# Altium project 5A_FOC_HybridStepperDrive.PrjPCB
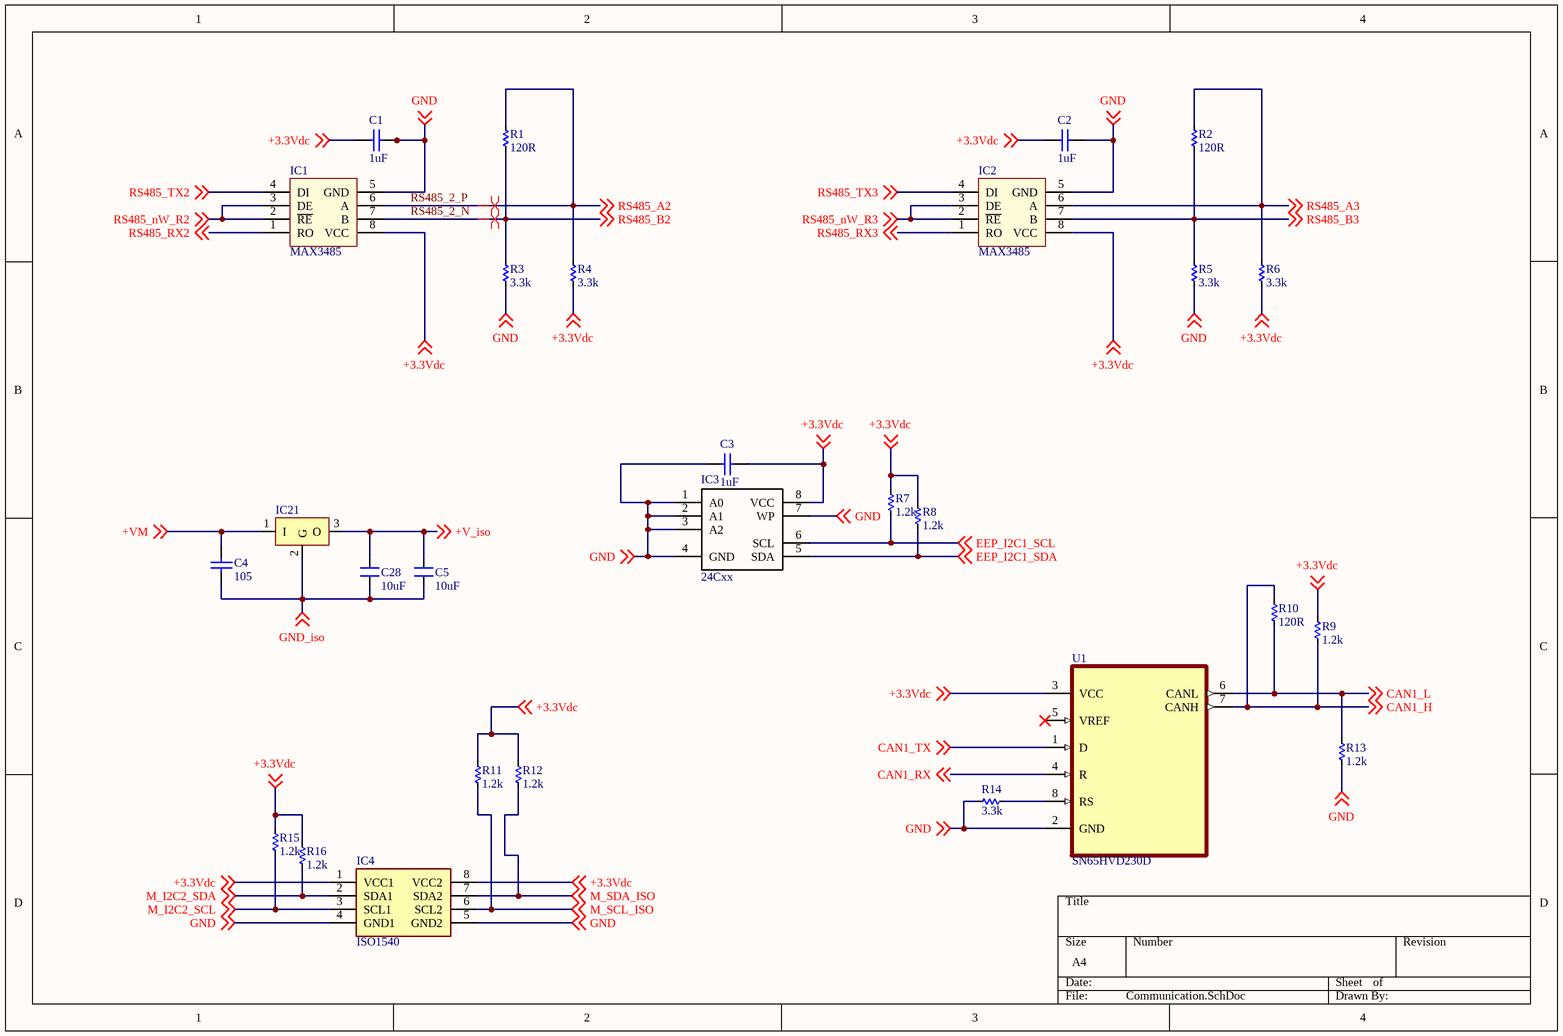
[diagram p0: Communication.SchDoc]
5 sheets, 89 parts. Net scope: flat (ports and power ports of the same name join across sheets).
Board file: PCB_5A_HYBRID_SERVO_V3_04_Oct_23.PcbDoc
Sheets:
  Communication.SchDoc
  DI_DO_AI_AO.SchDoc
  MCU_STM32L433RCT6.SchDoc
  Power_Supply.SchDoc
  Terminal.SchDoc

## Sheet Communication.SchDoc
size A4

### Parts
C1  1uF  [tu 0603]
C2  1uF  [tu 0603]
C3  1uF  [tu 0603]
C4  105  [tu 1206]
C5  10uF  [CM-0805 capacitor]
C28  10uF  [CM-0805 capacitor]
IC1  MAX3485  [SO8]
IC2  MAX3485  [SO8]
IC3  24Cxx  [SO8]
IC4  ISO1540  [SOIC127P600X175-8N]
IC21  78M05  [TO252-123]  (value not drawn)
R1  120R  [RES-SMD-0603]
R2  120R  [RES-SMD-0603]
R3  3.3k  [RES-SMD-0603]
R4  3.3k  [RES-SMD-0603]
R5  3.3k  [RES-SMD-0603]
R6  3.3k  [RES-SMD-0603]
R7  1.2k  [RES-SMD-0603]
R8  1.2k  [RES-SMD-0603]
R9  1.2k  [RES-SMD-0603]
R10  120R  [RES-SMD-0603]
R11  1.2k  [RES-SMD-0603]
R12  1.2k  [RES-SMD-0603]
R13  1.2k  [RES-SMD-0603]
R14  3.3k  [RES-SMD-0603]
R15  1.2k  [RES-SMD-0603]
R16  1.2k  [RES-SMD-0603]
U1  SN65HVD230D  [SO8]

### Nets
+3.3Vdc: C1.1 C2.1 C3.2 IC1.8(VCC) IC2.8(VCC) IC3.8(VCC) IC4.1(VCC1) IC4.8(VCC2) R4.2 R6.2 R7.1 R8.1 R9.1 R11.1 R12.1 R15.1 R16.1 U1.3(VCC) ; off-sheet +3.3Vdc
+V_iso: C5.2 C28.1 IC21.3(O) ; off-sheet +V_iso
+VM: C4.1 IC21.1(I) ; off-sheet +VM
CAN1_H: R9.2 R10.1 U1.7(CANH) ; off-sheet CAN1_H
CAN1_L: R10.2 R13.1 U1.6(CANL) ; off-sheet CAN1_L
CAN1_RX: U1.4(R) ; off-sheet CAN1_RX
CAN1_TX: U1.1(D) ; off-sheet CAN1_TX
EEP_I2C1_SCL: IC3.6(SCL) R7.2 ; off-sheet EEP_I2C1_SCL
EEP_I2C1_SDA: IC3.5(SDA) R8.2 ; off-sheet EEP_I2C1_SDA
GND: C1.2 C2.2 C3.1 IC1.5(GND) IC2.5(GND) IC3.1(A0) IC3.2(A1) IC3.3(A2) IC3.4(GND) IC3.7(WP) IC4.4(GND1) IC4.5(GND2) R3.2 R5.2 R13.2 R14.1 U1.2(GND) ; off-sheet GND
GND_iso: C4.2 C5.1 C28.2 IC21.2(G) ; off-sheet GND_iso
M_I2C2_SCL: IC4.3(SCL1) R15.2 ; off-sheet M_I2C2_SCL
M_I2C2_SDA: IC4.2(SDA1) R16.2 ; off-sheet M_I2C2_SDA
M_SCL_ISO: IC4.6(SCL2) R11.2 ; off-sheet M_SCL_ISO
M_SDA_ISO: IC4.7(SDA2) R12.2 ; off-sheet M_SDA_ISO
RS485_2_N: IC1.7(B) R1.2 R3.1 ; off-sheet RS485_B2  [also labelled RS485_B2]
RS485_2_P: IC1.6(A) R1.1 R4.1 ; off-sheet RS485_A2  [also labelled RS485_A2]
RS485_A3: IC2.6(A) R2.1 R6.1 ; off-sheet RS485_A3
RS485_B3: IC2.7(B) R2.2 R5.1 ; off-sheet RS485_B3
RS485_nW_R2: IC1.2(~{RE}) IC1.3(DE) ; off-sheet RS485_nW_R2
RS485_nW_R3: IC2.2(~{RE}) IC2.3(DE) ; off-sheet RS485_nW_R3
RS485_RX2: IC1.1(RO) ; off-sheet RS485_RX2
RS485_RX3: IC2.1(RO) ; off-sheet RS485_RX3
RS485_TX2: IC1.4(DI) ; off-sheet RS485_TX2
RS485_TX3: IC2.4(DI) ; off-sheet RS485_TX3
NetR14_2: R14.2 U1.8(RS)

Not connected (* = marked no-connect by the designer): U1 5(VREF)*

### Layout directives
differential pair: RS485_2_N, RS485_2_P

### Library data of the parts
C1-C3 = Tu 0603 102 50V 10%: Dán; Don_Vi: Con; So_Chan: 2; Ten_Linh_Kien: Tụ 0603 102-1nF 10% 50V; Ma_Hang: MH004566; Chung_Loai: Dán; Kieu_Chan: *
C4 = Tu 1206 105 50V 20%: Dán; Don_Vi: Con; So_Chan: 2; Ten_Linh_Kien: Tụ 1206 105-1uF 20% 50V; Ma_Hang: MH004545; Chung_Loai: Dán; Kieu_Chan: *
C5 C28 = CN: 0805_SMD_20pF; Value: 100pF
IC1 IC2 = MAX485: RS232 - RS485 (Same sn75176)
IC3 = 24Cxx: Standard 2-Wire Bus Interface Serial EEPROM; Value: DIP 8; Value: 24Cxx; Copyright by: VanDungEvn
IC4 = HPA02222DR: Integrated Circuit; Manufacturer_Name: Texas Instruments; Datasheet Link: http://www.ti.com/general/docs/suppproductinfo.tsp?distId=26&gotoUrl=http%3A%2F%2Fwww.ti.com%2Flit%2Fgpn%2Fiso1540; Height: 1.75mm; Manufacturer_Part_Number: HPA02222DR; Mouser Part Number: 595-HPA02222DR; Mouser Price/Stock: https://www.mouser.co.uk/ProductDetail/Texas-Instruments/HPA02222DR?qs=CinXaP2cUj2opC1RRUOhNg%3D%3D
IC21 = LM78xx: Positive Voltage Regulator; Note: Tab is connected to pin 3 (GND).; Published: 24-Aug-2001; LatestRevisionDate: 17-Jul-2002; LatestRevisionNote: Re-released for DXP Platform.; DatasheetVersion: Apr-1994; PackageVersion: Jul-1998; PackageReference: ISOWATT220AB; Publisher: Altium Limited; PackageDescription: TO, Thru-Hole, Vertical, Heatsink Mounted; 3 In-Line Leads; Pitch 2.54 mm; Pin sequence 1, 3, 2; ComponentLink1Description: Manufacturer Link; ComponentLink1URL: http://www.st.com/; ComponentLink2Description: Datasheet; ComponentLink2URL: http://www.st.com/stonline/products/literature/ds/2146/l78m05c.pdf
R1-R16 = Res-SMD: Resistor; Manufacturer: Generic Components; Class: Passive; Published: 08/06/2000; Publisher: Altium Hobart Technology Centre
U1 = SN65HVD230D: 1/1 Transceiver Half CANbus 8-SOIC; MF: Texas Instruments; Digi-Key_Purchase_URL: https://www.digikey.de/product-detail/en/texas-instruments/SN65HVD230D/SN65HVD230D-ND/1574496?utm_source=snapeda&utm_medium=aggregator&utm_campaign=symbol; Digi-Key_Part_Number: SN65HVD230D-ND; SnapEDA_Link: https://www.snapeda.com/parts/SN65HVD230D/Texas%20Instruments/view-part/51766/?ref=snap; Package: SOIC-8 Texas Instruments; Value: *; MP: SN65HVD230D

## Sheet DI_DO_AI_AO.SchDoc
size A4
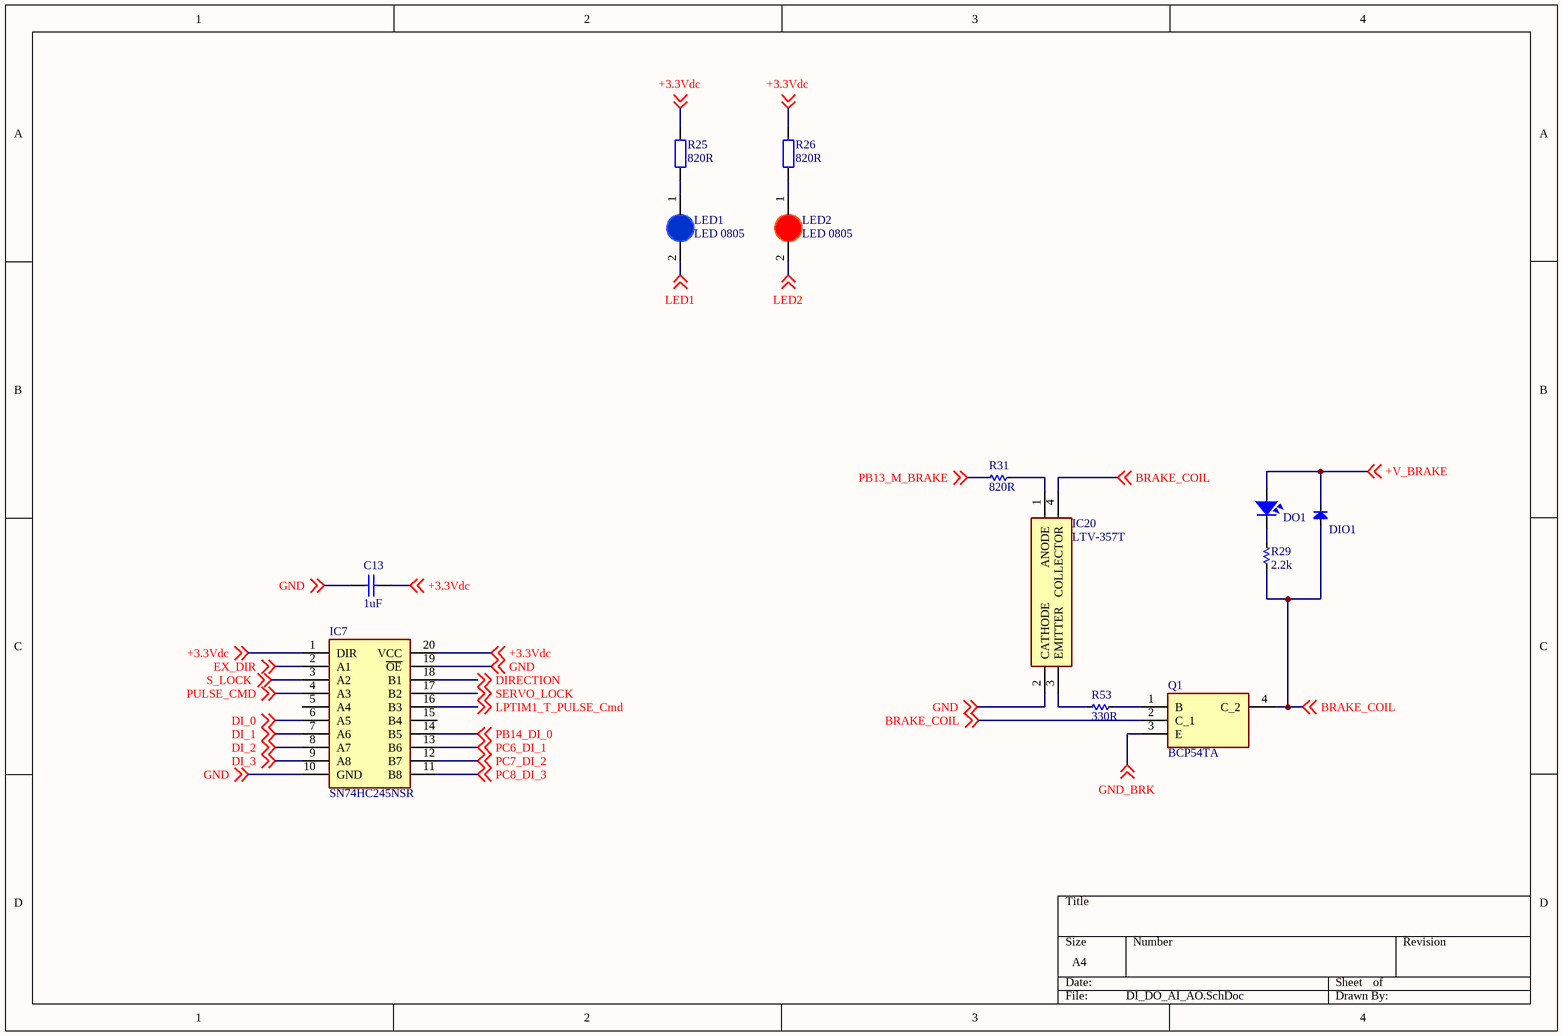
[diagram p1: DI_DO_AI_AO.SchDoc]

### Parts
C13  1uF  [tu 0805]
DIO1  Diode SMD  [DIO-SMD-106]  (value not drawn)
DO1  LED  [LED-0805-Yellow]  (value not drawn)
IC7  SN74HC245NSR  [SOIC127P780X200-20N]
IC20  LTV-357T  [LTV-357T]
LED1  LED 0805  [LED-0805-Blue]
LED2  LED 0805  [LED-0805-Red]
Q1  BCP54TA  [SOT230P700X165-4N]
R25  820R  [tro smd 0805]
R26  820R  [tro smd 0805]
R29  2.2k  [RES-SMD-0805]
R31  820R  [RES-SMD-0805]
R53  330R  [RES-SMD-0805]

### Nets
+3.3Vdc: C13.1 IC7.1(DIR) IC7.20(VCC) R25.2 R26.2 ; off-sheet +3.3Vdc
+V_BRAKE: DIO1.2(K) DO1.1 ; off-sheet +V_BRAKE
BRAKE_COIL: DIO1.1(A) IC20.4(COLLECTOR) Q1.2(C_1) Q1.4(C_2) R29.2 ; off-sheet BRAKE_COIL
DI_0: IC7.6(A5) ; off-sheet DI_0
DI_1: IC7.7(A6) ; off-sheet DI_1
DI_2: IC7.8(A7) ; off-sheet DI_2
DI_3: IC7.9(A8) ; off-sheet DI_3
DIRECTION: IC7.18(B1) ; off-sheet DIRECTION
EX_DIR: IC7.2(A1) ; off-sheet EX_DIR
GND: C13.2 IC7.10(GND) IC7.19(~{OE}) IC20.2(CATHODE) ; off-sheet GND
GND_BRK: Q1.3(E) ; off-sheet GND_BRK
LED1: LED1.2(K) ; off-sheet LED1
LED2: LED2.2(K) ; off-sheet LED2
LPTIM1_T_PULSE_Cmd: IC7.16(B3) ; off-sheet LPTIM1_T_PULSE_Cmd
PB13_M_BRAKE: R31.2 ; off-sheet PB13_M_BRAKE
PB14_DI_0: IC7.14(B5) ; off-sheet PB14_DI_0
PC6_DI_1: IC7.13(B6) ; off-sheet PC6_DI_1
PC7_DI_2: IC7.12(B7) ; off-sheet PC7_DI_2
PC8_DI_3: IC7.11(B8) ; off-sheet PC8_DI_3
PULSE_CMD: IC7.4(A3) ; off-sheet PULSE_CMD
S_LOCK: IC7.3(A2) ; off-sheet S_LOCK
SERVO_LOCK: IC7.17(B2) ; off-sheet SERVO_LOCK
NetDO1_2: DO1.2 R29.1
NetIC20_1: IC20.1(ANODE) R31.1
NetIC20_3: IC20.3(EMITTER) R53.2
NetLED1_1: LED1.1(A) R25.1
NetLED2_1: LED2.1(A) R26.1
NetQ1_1: Q1.1(B) R53.1

Not connected (* = marked no-connect by the designer): IC7 5(A4) 15(B4)

### Library data of the parts
C13 = Tu 0805 10pF 50V 10%: Dán; Don_Vi: Con; So_Chan: 2; Ten_Linh_Kien: Tụ 0805 10P 10% 50V; Ma_Hang: MH004554; Chung_Loai: Dán; Kieu_Chan: *
DIO1 = Diode SMD: Default Diode; Code - JEDEC: DO-214-AB; Value: 1N5007; Published: 8-Jun-2000; Revision: July-2002: Re-released for DXP Platform.; Publisher: Altium Limited
DO1 = LED SMD: Value: LED 3 - 5 ly 2 Colour
IC7 = SN74HC245NSR: Integrated Circuit; Manufacturer_Name: Texas Instruments; Datasheet Link: https://www.ti.com/lit/gpn/SN74HC245; Height: 2mm; Manufacturer_Part_Number: SN74HC245NSR; Mouser Part Number: 595-SN74HC245NSR; Mouser Price/Stock: https://www.mouser.co.uk/ProductDetail/Texas-Instruments/SN74HC245NSR?qs=YhsVCygOPE264XdBhel1Tg%3D%3D; Arrow Part Number: SN74HC245NSR; Arrow Price/Stock: https://www.arrow.com/en/products/sn74hc245nsr/texas-instruments?region=nac
IC20 = LTV-357T: Integrated Circuit; Manufacturer_Name: Lite-On; Datasheet Link: http://uk.rs-online.com/web/p/products/6912088; Manufacturer_Part_Number: LTV-357T; Mouser Part Number: 859-LTV-357T; Mouser Price/Stock: https://www.mouser.co.uk/ProductDetail/Lite-On/LTV-357T?qs=IhlP1sn3qi5zhJzi4zUCwQ%3D%3D; Arrow Part Number: LTV-357T; Arrow Price/Stock: https://www.arrow.com/en/products/ltv-357t/lite-on-technology?region=nac
LED1 = LED 0805 Xanh Duong: Dán; Don_Vi: Con; Ma_Hang: MH002327; Ten_Linh_Kien: LED 0805 Màu Xanh Dương (Blue); Ghi_Chu: *; Kieu_Chan: *; Chung_Loai: Dán
LED2 = LED 0805 Do: Dán; Don_Vi: Con; Ma_Hang: MH000897; Ten_Linh_Kien: LED 0805 Màu Đỏ (Red); Ghi_Chu: *; Kieu_Chan: *; Chung_Loai: Dán
Q1 = BCP54TA: Transistor BJT NPN; Manufacturer_Name: Diodes Inc.; Datasheet Link: https://www.diodes.com/assets/Datasheets/BCP54_55_56.pdf; Height: 1.65mm; Manufacturer_Part_Number: BCP54TA; Mouser Part Number: 522-BCP54TA; Mouser Price/Stock: https://www.mouser.co.uk/ProductDetail/Diodes-Incorporated/BCP54TA?qs=fKsNvYl5pt81P4xkpCoZ4w%3D%3D; Arrow Part Number: BCP54TA; Arrow Price/Stock: https://www.arrow.com/en/products/bcp54ta/diodes-incorporated?region=nac
R25 R26 = Tro 0805 1% 2k: Dán; Don_Vi: Con; So_Chan: 2; Ten_Linh_Kien: Trở 0805 1% 2k; Ma_Hang: MH005471; Chung_Loai: Dán; Kieu_Chan: *
R29 R31 R53 = Res-SMD: as R1 on sheet Communication; Published: 08/06/2000; Publisher: Altium Hobart Technology Centre

## Sheet MCU_STM32L433RCT6.SchDoc
size A4
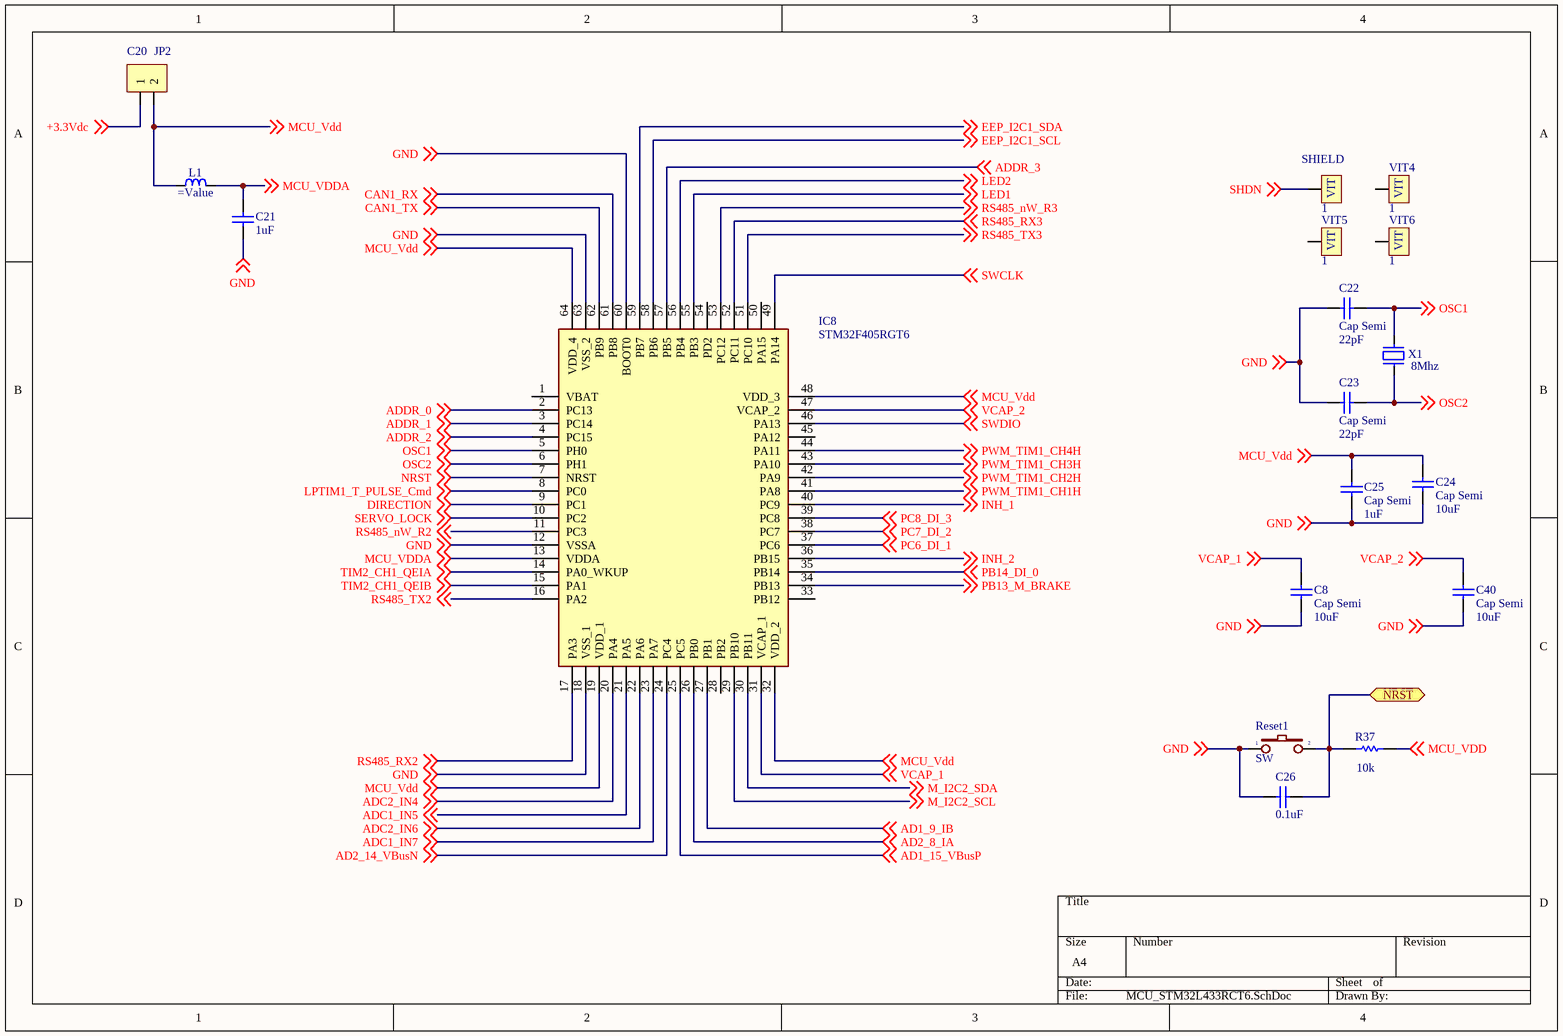
[diagram p2: MCU_STM32L433RCT6.SchDoc]

### Parts
C8  Cap Semi  value 10uF  [CN-SMD-0805]
C20  JP2  [JP2-CLOSED]
C21  1uF  [tu 0805]
C22  Cap Semi  value 22pF  [CN-SMD-0805]
C23  Cap Semi  value 22pF  [CN-SMD-0805]
C24  Cap Semi  value 10uF  [CN-SMD-0805]
C25  Cap Semi  value 1uF  [CN-SMD-0805]
C26  0.1uF  [CN-SMD-0805]
C40  Cap Semi  value 10uF  [CN-SMD-0805]
IC8  STM32F405RGT6  [QFP50P1200X1200X160-64N]
L1  (no value)  [RES 0805]
R37  value 10k  [RES-SMD-0805]  (hidden comment: 0805)
Reset1  SW  [SW1-SMD]
SHIELD  1  [VIT]
VIT4  1  [VIT]
VIT5  1  [VIT]
VIT6  1  [VIT]
X1  8Mhz  [XT2]

### Ports
NRST (bidir)

### Nets
+3.3Vdc: C20.1 ; off-sheet +3.3Vdc
AD1_9_IB: IC8.27(PB1) ; off-sheet AD1_9_IB
AD1_15_VBusP: IC8.25(PC5) ; off-sheet AD1_15_VBusP
AD2_8_IA: IC8.26(PB0) ; off-sheet AD2_8_IA
AD2_14_VBusN: IC8.24(PC4) ; off-sheet AD2_14_VBusN
ADC1_IN5: IC8.21(PA5) ; off-sheet ADC1_IN5
ADC1_IN7: IC8.23(PA7) ; off-sheet ADC1_IN7
ADC2_IN4: IC8.20(PA4) ; off-sheet ADC2_IN4
ADC2_IN6: IC8.22(PA6) ; off-sheet ADC2_IN6
ADDR_0: IC8.2(PC13) ; off-sheet ADDR_0
ADDR_1: IC8.3(PC14) ; off-sheet ADDR_1
ADDR_2: IC8.4(PC15) ; off-sheet ADDR_2
ADDR_3: IC8.57(PB5) ; off-sheet ADDR_3
CAN1_RX: IC8.61(PB8) ; off-sheet CAN1_RX
CAN1_TX: IC8.62(PB9) ; off-sheet CAN1_TX
DIRECTION: IC8.9(PC1) ; off-sheet DIRECTION
EEP_I2C1_SCL: IC8.58(PB6) ; off-sheet EEP_I2C1_SCL
EEP_I2C1_SDA: IC8.59(PB7) ; off-sheet EEP_I2C1_SDA
GND: C8.1 C21.1 C22.1 C23.1 C24.1 C25.1 C26.1 C40.1 IC8.12(VSSA) IC8.18(VSS_1) IC8.60(BOOT0) IC8.63(VSS_2) Reset1.1 ; off-sheet GND
INH_1: IC8.40(PC9) ; off-sheet INH_1
INH_2: IC8.36(PB15) ; off-sheet INH_2
LED1: IC8.55(PB3) ; off-sheet LED1
LED2: IC8.56(PB4) ; off-sheet LED2
LPTIM1_T_PULSE_Cmd: IC8.8(PC0) ; off-sheet LPTIM1_T_PULSE_Cmd
M_I2C2_SCL: IC8.29(PB10) ; off-sheet M_I2C2_SCL
M_I2C2_SDA: IC8.30(PB11) ; off-sheet M_I2C2_SDA
MCU_VDD: C20.2 C24.2 C25.2 IC8.19(VDD_1) IC8.32(VDD_2) IC8.48(VDD_3) IC8.64(VDD_4) L1.1 R37.2 ; off-sheet MCU_VDD, off-sheet MCU_Vdd
MCU_VDDA: C21.2 IC8.13(VDDA) L1.2 ; off-sheet MCU_VDDA
NRST: IC8.7(NRST) ; off-sheet NRST
OSC1: C22.2 IC8.5(PH0) X1.1 ; off-sheet OSC1
OSC2: C23.2 IC8.6(PH1) X1.2 ; off-sheet OSC2
PB13_M_BRAKE: IC8.34(PB13) ; off-sheet PB13_M_BRAKE
PB14_DI_0: IC8.35(PB14) ; off-sheet PB14_DI_0
PC6_DI_1: IC8.37(PC6) ; off-sheet PC6_DI_1
PC7_DI_2: IC8.38(PC7) ; off-sheet PC7_DI_2
PC8_DI_3: IC8.39(PC8) ; off-sheet PC8_DI_3
PWM_TIM1_CH1H: IC8.41(PA8) ; off-sheet PWM_TIM1_CH1H
PWM_TIM1_CH2H: IC8.42(PA9) ; off-sheet PWM_TIM1_CH2H
PWM_TIM1_CH3H: IC8.43(PA10) ; off-sheet PWM_TIM1_CH3H
PWM_TIM1_CH4H: IC8.44(PA11) ; off-sheet PWM_TIM1_CH4H
RS485_nW_R2: IC8.11(PC3) ; off-sheet RS485_nW_R2
RS485_nW_R3: IC8.53(PC12) ; off-sheet RS485_nW_R3
RS485_RX2: IC8.17(PA3) ; off-sheet RS485_RX2
RS485_RX3: IC8.52(PC11) ; off-sheet RS485_RX3
RS485_TX2: IC8.16(PA2) ; off-sheet RS485_TX2
RS485_TX3: IC8.51(PC10) ; off-sheet RS485_TX3
SERVO_LOCK: IC8.10(PC2) ; off-sheet SERVO_LOCK
SHDN: SHIELD.VIT1 ; off-sheet SHDN
SWCLK: IC8.49(PA14) ; off-sheet SWCLK
SWDIO: IC8.46(PA13) ; off-sheet SWDIO
TIM2_CH1_QEIA: IC8.14(PA0_WKUP) ; off-sheet TIM2_CH1_QEIA
TIM2_CH1_QEIB: IC8.15(PA1) ; off-sheet TIM2_CH1_QEIB
VCAP_1: C8.2 IC8.31(VCAP_1) ; off-sheet VCAP_1
VCAP_2: C40.2 IC8.47(VCAP_2) ; off-sheet VCAP_2
NetC26_2: C26.2 R37.1 Reset1.2 ; port NRST

Not connected (* = marked no-connect by the designer): IC8 1(VBAT) 28(PB2) 33(PB12) 45(PA12) 50(PA15) 54(PD2); VIT4 VIT1(1); VIT5 VIT1(1); VIT6 VIT1(1)

### Library data of the parts
C8 C22-C26 C40 = Cap Semi: Capacitor (Semiconductor SIM Model); Published: 8-Jun-2000; LatestRevisionDate: 29-May-2009; LatestRevisionNote: IPC-7351 Footprint Added.; PackageReference: C1206; Publisher: Altium Limited; PackageDescription: Chip Capacitor
C20 = JP2: WR-PHD 2.54 mm Angled Socket Header; Manufacturer: W¨¹rth Elektronik eiSos GmbH; partNo: 613002143121; ComponentLink1 Description: Manufacturer; ComponentLink2 Description: Datasheet; NoPins: 02; Created Date: 29 March 2013; ComponentLink1URL: http://www.we-online.com; ComponentLink2URL: http://katalog.we-online.de/em/datasheet/6130xx143121.pdf; Created by: Karrer Zheng
C21 = Tu 0805 10pF 50V 10%: as C13 on sheet DI_DO_AI_AO; Chung_Loai: Dán; Kieu_Chan: *
IC8 = STM32F405RGT6: Integrated Circuit; Manufacturer_Name: STMicroelectronics; Datasheet Link: http://www.st.com/web/en/resource/technical/document/datasheet/DM00037051.pdf; Height: 1.6mm; Manufacturer_Part_Number: STM32F405RGT6; Mouser Part Number: 511-STM32F405RGT6; Mouser Price/Stock: https://www.mouser.co.uk/ProductDetail/STMicroelectronics/STM32F405RGT6?qs=Z8%252BeY1k3TIKgj7QWsYGpQw%3D%3D; Arrow Part Number: STM32F405RGT6; Arrow Price/Stock: https://www.arrow.com/en/products/stm32f405rgt6/stmicroelectronics?region=nac
L1 = Inductor
R37 = Res1: Resistor; Published: 8-Jun-2000; LatestRevisionDate: 17-Jul-2002; LatestRevisionNote: Re-released for DXP Platform.; PackageReference: AXIAL-0.3; Publisher: Altium Limited; PackageDescription: Axial Device, Thru-Hole; 2 Leads; 0.3 in Pin Spacing
Reset1 = SW2: Switch button 2 pin; Value: SW chip 2 pin
SHIELD VIT4-VIT6 = VIT: Oc Vit
X1 = XT2: Crystal, 32.768 KHz, -40 to 85 degC, 3.2 x 1.5 x 0.9 mm SMD; Value: 4Mhz

## Sheet Power_Supply.SchDoc
size A4
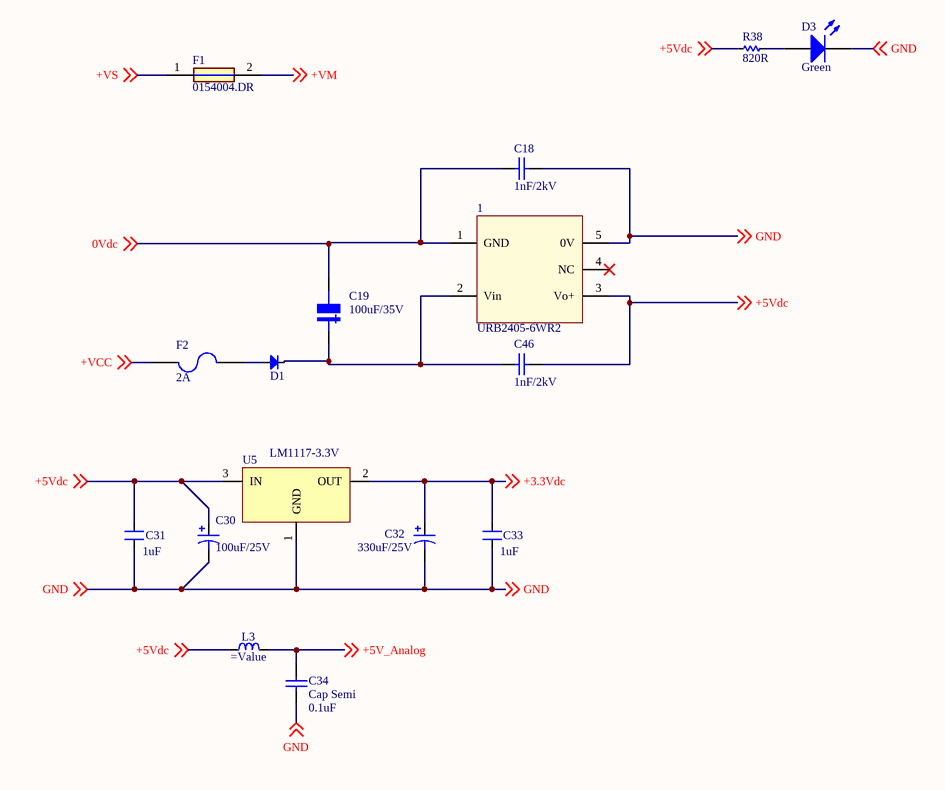
[diagram p3: Power_Supply.SchDoc]

### Parts
1  URB2405-6WR2  [URB2405_6WR2]
C18  1nF/2kV  [Cap 3KV 5mm]
C19  100uF/35V  [tu nhom 10 (g)]
C30  100uF/25V  [Cap size C]
C31  1uF  [CM-0805 capacitor]
C32  330uF/25V  [Cap size C]
C33  1uF  [CM-0805 capacitor]
C34  Cap Semi  value 0.1uF  [CN-SMD-0805]
C46  1nF/2kV  [Cap 3KV 5mm]
D1  Diode SMD  [DIO-SMD-A]  (value not drawn)
D3  Green  [LED-0805-Green]
F1  0154004.DR  [0154001.DRT]
F2  2A  [FUSE_RESETTABLE_SMD_1812]
L3  (no value)  [RES 1206]
R38  820R  [RES-SMD-0805]
U5  LM1117-3.3V  [SOT223]

### Nets
0Vdc: 1.1(GND) C18.1 C19.2 ; off-sheet 0Vdc
+3.3Vdc: C32.1 C33.1 U5.2(OUT) ; off-sheet +3.3Vdc
+5V_Analog: C34.1 L3.2 ; off-sheet +5V_Analog
+5Vdc: 1.3(Vo+) C30.1 C31.1 C46.2 L3.1 R38.1 U5.3(IN) ; off-sheet +5Vdc
+VCC: F2.1 ; off-sheet +VCC
+VM: F1.2 ; off-sheet +VM
+VS: F1.1 ; off-sheet +VS
GND: 1.5(0V) C18.2 C30.2 C31.2 C32.2 C33.2 C34.2 D3.2(K) U5.1(GND) ; off-sheet GND
Net1_2: 1.2(Vin) C19.1 C46.1 D1.2(K)
NetD1_1: D1.1(A) F2.2
NetD3_1: D3.1(A) R38.2

Not connected (* = marked no-connect by the designer): 1 4(NC)*

### Notes on the sheet
- (in symbol Tu Nhom 100uF 35V) +

### Library data of the parts
C18 C46 = Cap: Capacitor; Published: 8-Jun-2000; LatestRevisionDate: 17-Jul-2002; LatestRevisionNote: Re-released for DXP Platform.; PackageReference: RAD-0.3; Publisher: Altium Limited; Value: 1nF/2kV
C19 = Tu Nhom 100uF 35V: Dán; Don_Vi: Con; Ten_Linh_Kien: Tụ Nhôm 100uF 35V; Ma_Hang: MH004019; So_Chan: 2; Chung_Loai: Dán; Kieu_Chan: *
C30 C32 = Cap Pol2: Polarized Capacitor (Axial); Published: 8-Jun-2000; LatestRevisionDate: 17-Jul-2002; LatestRevisionNote: Re-released for DXP Platform.; PackageReference: POLAR0.8; Publisher: Altium Limited
C31 C33 = CN: 0805_SMD_20pF; Value: 100pF
C34 = Cap Semi: Capacitor (Semiconductor SIM Model); Published: 8-Jun-2000; LatestRevisionDate: 29-May-2009; LatestRevisionNote: IPC-7351 Footprint Added.; PackageReference: C1206; Publisher: Altium Limited; PackageDescription: Chip Capacitor
D1 = Diode SMD: as DIO1 on sheet DI_DO_AI_AO; Published: 8-Jun-2000; Revision: July-2002: Re-released for DXP Platform.; Publisher: Altium Limited
D3 = LED2: Typical RED, GREEN, YELLOW, AMBER GaAs LED; Published: 8-Jun-2000; LatestRevisionDate: 17-Jul-2002; LatestRevisionNote: Re-released for DXP Platform.; PackageVersion: Feb-2002; PackageReference: 3.2X1.6X1.1; Publisher: Altium Limited; PackageDescription: SM LED; 2 Flat Leads
F1 = 0154004.DR: Fuse; Manufacturer_Name: LITTELFUSE; Datasheet Link: http://m.littelfuse.com/~/media/electronics/datasheets/fuses/littelfuse_fuse_154_154t_154l_154tl_datasheet.pdf.pdf; Manufacturer_Part_Number: 0154004.DR; Mouser Part Number: 576-0154004.DR; Mouser Price/Stock: https://www.mouser.co.uk/ProductDetail/Littelfuse/0154004.DR?qs=gu7KAQ731UQeedYeniUNnQ%3D%3D; Arrow Part Number: 0154004.DR; Arrow Price/Stock: https://www.arrow.com/en/products/0154004.dr/littelfuse?region=nac
F2 = Fuse 2: Fuse; Published: 8-Jun-2000; LatestRevisionDate: 17-Jul-2002; LatestRevisionNote: Re-released for DXP Platform.; PackageReference: PIN-W2/E2.8; Publisher: Altium Limited
L3 = Inductor
R38 = Res-SMD: as R1 on sheet Communication; Published: 08/06/2000; Publisher: Altium Hobart Technology Centre
U5 = LM1117: 800mA Low-Dropout Linear Regulator; Creator: Nguyen Ba Bien; Website: http://group3i.net

## Sheet Terminal.SchDoc
size A4
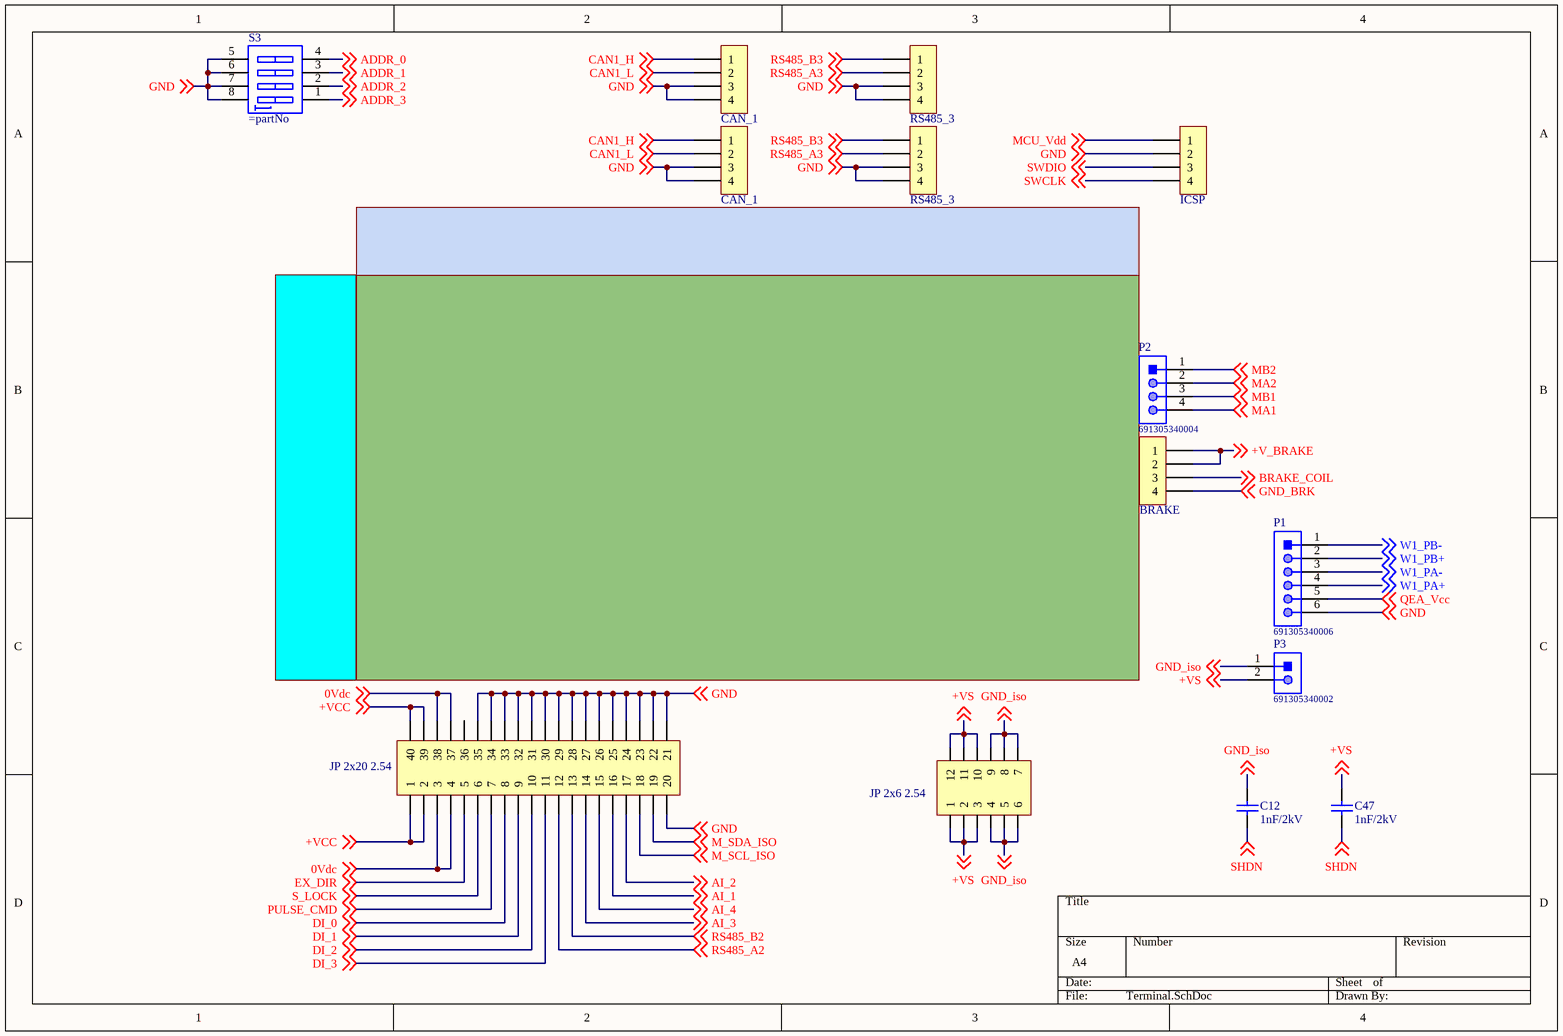
[diagram p4: Terminal.SchDoc]

### Parts
C12  1nF/2kV  [Cap 3KV 5mm]
C47  1nF/2kV  [Cap 3KV 5mm]
H1  CAN_1  [Header 4P DC 2.54]
H2  RS485_3  [Header 4P DC 2.54]
H4  ICSP  [Header 4P DC 2.54]
H5  BRAKE  [Header 4P DC 2.54]
H6  CAN_1  [Header 4P DC 2.54]
H8  RS485_3  [Header 4P DC 2.54]
JP1  JP 2x20 2.54  [JP 2x20 DC]
JP2  JP 2x6 2.54  [JP 2x6 DC]
P1  691305340006  [691305340006]
P2  691305340004  [691305340004]
P3  691305340002  [691305340002]
S3  (no value)  [SW-DIP4]

### Nets
0Vdc: JP1.3 JP1.4 JP1.37 JP1.38 ; off-sheet 0Vdc
+V_BRAKE: H5.1 H5.2 ; off-sheet +V_BRAKE
+VCC: JP1.1 JP1.2 JP1.39 JP1.40 ; off-sheet +VCC
+VS: C47.2 JP2.1 JP2.2 JP2.3 JP2.10 JP2.11 JP2.12 P3.2 ; off-sheet +VS
ADDR_0: S3.4 ; off-sheet ADDR_0
ADDR_1: S3.3 ; off-sheet ADDR_1
ADDR_2: S3.2 ; off-sheet ADDR_2
ADDR_3: S3.1 ; off-sheet ADDR_3
AI_1: JP1.16 ; off-sheet AI_1
AI_2: JP1.17 ; off-sheet AI_2
AI_3: JP1.14 ; off-sheet AI_3
AI_4: JP1.15 ; off-sheet AI_4
BRAKE_COIL: H5.3 ; off-sheet BRAKE_COIL
CAN1_H: H1.1 H6.1 ; off-sheet CAN1_H
CAN1_L: H1.2 H6.2 ; off-sheet CAN1_L
DI_0: JP1.8 ; off-sheet DI_0
DI_1: JP1.9 ; off-sheet DI_1
DI_2: JP1.10 ; off-sheet DI_2
DI_3: JP1.11 ; off-sheet DI_3
EX_DIR: JP1.5 ; off-sheet EX_DIR
GND: H1.3 H1.4 H2.3 H2.4 H4.2 H6.3 H6.4 H8.3 H8.4 JP1.20 JP1.21 JP1.22 JP1.23 JP1.24 JP1.25 JP1.26 JP1.27 JP1.28 JP1.29 JP1.30 JP1.31 JP1.32 JP1.33 JP1.34 JP1.35 P1.6 S3.5 S3.6 S3.7 S3.8 ; off-sheet GND
GND_BRK: H5.4 ; off-sheet GND_BRK
GND_iso: C12.2 JP2.4 JP2.5 JP2.6 JP2.7 JP2.8 JP2.9 P3.1 ; off-sheet GND_iso
M_SCL_ISO: JP1.18 ; off-sheet M_SCL_ISO
M_SDA_ISO: JP1.19 ; off-sheet M_SDA_ISO
MA1: P2.4 ; off-sheet MA1
MA2: P2.2 ; off-sheet MA2
MB1: P2.3 ; off-sheet MB1
MB2: P2.1 ; off-sheet MB2
MCU_VDD: H4.1 ; off-sheet MCU_Vdd
PULSE_CMD: JP1.7 ; off-sheet PULSE_CMD
QEA_Vcc: P1.5 ; off-sheet QEA_Vcc
RS485_A2: JP1.12 ; off-sheet RS485_A2  [project net RS485_2_P]
RS485_A3: H2.2 H8.2 ; off-sheet RS485_A3
RS485_B2: JP1.13 ; off-sheet RS485_B2  [project net RS485_2_N]
RS485_B3: H2.1 H8.1 ; off-sheet RS485_B3
S_LOCK: JP1.6 ; off-sheet S_LOCK
SHDN: C12.1 C47.1 ; off-sheet SHDN
SWCLK: H4.4 ; off-sheet SWCLK
SWDIO: H4.3 ; off-sheet SWDIO
W1_PA+: P1.4 ; off-sheet W1_PA+
W1_PA-: P1.3 ; off-sheet W1_PA-
W1_PB+: P1.2 ; off-sheet W1_PB+
W1_PB-: P1.1 ; off-sheet W1_PB-

Not connected (* = marked no-connect by the designer): JP1 36

### Library data of the parts
C12 C47 = Cap: Capacitor; Published: 8-Jun-2000; LatestRevisionDate: 17-Jul-2002; LatestRevisionNote: Re-released for DXP Platform.; PackageReference: RAD-0.3; Publisher: Altium Limited; Value: 1nF/2kV
H1 H2 H4-H6 H8 = Header 4P 2.54 Duc Cong: Cắm; Ten_Linh_Kien: Header 4P XH2.54-4P Đực Cong; Don_Vi: Con; Ma_Hang: MH001310; Chung_Loai: Cắm
JP1 = JP 2x20 2.54 Duc Cong: Cắm; Ten_Linh_Kien: Jump Đôi Đực 2.54MM 2x40P Cong; Don_Vi: Con; Ma_Hang: MH005385; Ghi_Chu: *; Kieu_Chan: *; Chung_Loai: Cắm
JP2 = JP 2x6 2.54 Duc Cong: Cắm; Ten_Linh_Kien: Jump Đôi Đực 2.54MM 2x40P Cong; Don_Vi: Con; Ma_Hang: MH005385; Ghi_Chu: *; Kieu_Chan: *; Chung_Loai: Cắm
P1 = 691305340006: Serie 3053 - 3.81mm Horizontal PCB Header with Plastic Latch WR-TBL, 6 pin; Pin Number: 6; Gender: Male; ComponentLink1Description: Manufacturer; ComponentLink1URL: http://www.we-online.de; ComponentLink2Description: Datasheet; ComponentLink2URL: http://katalog.we-online.de/em/datasheet/691305340006.pdf; Part Number: 691305340006; Published Date: June 2018; Publisher: Wurth Elektronik; Pitch: 3.81 mm; Operating Temperature: -40 to 105 degC; Mounting Technology: THT; Packaging: Box
P2 = 691305340004: Serie 3053 - 3.81mm Horizontal PCB Header with Plastic Latch WR-TBL, 4 pin; Pin Number: 4; Gender: Male; ComponentLink1Description: Manufacturer; ComponentLink1URL: http://www.we-online.de; ComponentLink2Description: Datasheet; ComponentLink2URL: http://katalog.we-online.de/em/datasheet/691305340004.pdf; Part Number: 691305340004; Published Date: June 2018; Publisher: Wurth Elektronik; Pitch: 3.81 mm; Operating Temperature: -40 to 105 degC; Mounting Technology: THT; Packaging: Box
P3 = 691305340002: Serie 3053 - 3.81mm Horizontal PCB Header with Plastic Latch WR-TBL, 2 pin; Pin Number: 2; Gender: Male; ComponentLink1Description: Manufacturer; ComponentLink1URL: http://www.we-online.de; ComponentLink2Description: Datasheet; ComponentLink2URL: http://katalog.we-online.de/em/datasheet/691305340002.pdf; Part Number: 691305340002; Published Date: June 2018; Publisher: Wurth Elektronik; Pitch: 3.81 mm; Operating Temperature: -40 to 105 degC; Mounting Technology: THT; Packaging: Box
S3 = SWDIP4: WS-DITV 2.54 mm small compact THT flat actuator with top tape; Manufacturer: Wurth Elektronik; Part No.: 418127160904; ComponentLink1 Description: Manufacturer; ComponentLink2 Description: Datasheet; Pole: 04; Created Date: Dec.2015; ComponentLink1URL: http://www.we-online.com; ComponentLink2URL: http://katalog.we-online.de/em/datasheet/4181271609xx.pdf; Created by: Baojun Chen

## Nets that join several sheets
0Vdc: Power_Supply (1.1 C18.1 C19.2), Terminal (JP1.3 JP1.4 JP1.37 JP1.38)
+3.3Vdc: Communication (18 pins), DI_DO_AI_AO (5 pins), MCU_STM32L433RCT6 (C20.1), Power_Supply (C32.1 C33.1 U5.2)
+V_BRAKE: DI_DO_AI_AO (DIO1.2 DO1.1), Terminal (H5.1 H5.2)
+VCC: Power_Supply (F2.1), Terminal (JP1.1 JP1.2 JP1.39 JP1.40)
+VM: Communication (C4.1 IC21.1), Power_Supply (F1.2)
+VS: Power_Supply (F1.1), Terminal (8 pins)
ADDR_0: MCU_STM32L433RCT6 (IC8.2), Terminal (S3.4)
ADDR_1: MCU_STM32L433RCT6 (IC8.3), Terminal (S3.3)
ADDR_2: MCU_STM32L433RCT6 (IC8.4), Terminal (S3.2)
ADDR_3: MCU_STM32L433RCT6 (IC8.57), Terminal (S3.1)
BRAKE_COIL: DI_DO_AI_AO (5 pins), Terminal (H5.3)
CAN1_H: Communication (R9.2 R10.1 U1.7), Terminal (H1.1 H6.1)
CAN1_L: Communication (R10.2 R13.1 U1.6), Terminal (H1.2 H6.2)
CAN1_RX: Communication (U1.4), MCU_STM32L433RCT6 (IC8.61)
CAN1_TX: Communication (U1.1), MCU_STM32L433RCT6 (IC8.62)
DI_0: DI_DO_AI_AO (IC7.6), Terminal (JP1.8)
DI_1: DI_DO_AI_AO (IC7.7), Terminal (JP1.9)
DI_2: DI_DO_AI_AO (IC7.8), Terminal (JP1.10)
DI_3: DI_DO_AI_AO (IC7.9), Terminal (JP1.11)
DIRECTION: DI_DO_AI_AO (IC7.18), MCU_STM32L433RCT6 (IC8.9)
EEP_I2C1_SCL: Communication (IC3.6 R7.2), MCU_STM32L433RCT6 (IC8.58)
EEP_I2C1_SDA: Communication (IC3.5 R8.2), MCU_STM32L433RCT6 (IC8.59)
EX_DIR: DI_DO_AI_AO (IC7.2), Terminal (JP1.5)
GND: Communication (17 pins), DI_DO_AI_AO (C13.2 IC7.10 IC7.19 IC20.2), MCU_STM32L433RCT6 (13 pins), Power_Supply (9 pins), Terminal (30 pins)
GND_BRK: DI_DO_AI_AO (Q1.3), Terminal (H5.4)
GND_iso: Communication (C4.2 C5.1 C28.2 IC21.2), Terminal (8 pins)
LED1: DI_DO_AI_AO (LED1.2), MCU_STM32L433RCT6 (IC8.55)
LED2: DI_DO_AI_AO (LED2.2), MCU_STM32L433RCT6 (IC8.56)
LPTIM1_T_PULSE_Cmd: DI_DO_AI_AO (IC7.16), MCU_STM32L433RCT6 (IC8.8)
M_I2C2_SCL: Communication (IC4.3 R15.2), MCU_STM32L433RCT6 (IC8.29)
M_I2C2_SDA: Communication (IC4.2 R16.2), MCU_STM32L433RCT6 (IC8.30)
M_SCL_ISO: Communication (IC4.6 R11.2), Terminal (JP1.18)
M_SDA_ISO: Communication (IC4.7 R12.2), Terminal (JP1.19)
MCU_VDD: MCU_STM32L433RCT6 (9 pins), Terminal (H4.1)
PB13_M_BRAKE: DI_DO_AI_AO (R31.2), MCU_STM32L433RCT6 (IC8.34)
PB14_DI_0: DI_DO_AI_AO (IC7.14), MCU_STM32L433RCT6 (IC8.35)
PC6_DI_1: DI_DO_AI_AO (IC7.13), MCU_STM32L433RCT6 (IC8.37)
PC7_DI_2: DI_DO_AI_AO (IC7.12), MCU_STM32L433RCT6 (IC8.38)
PC8_DI_3: DI_DO_AI_AO (IC7.11), MCU_STM32L433RCT6 (IC8.39)
PULSE_CMD: DI_DO_AI_AO (IC7.4), Terminal (JP1.7)
RS485_2_N: Communication (IC1.7 R1.2 R3.1), Terminal (JP1.13)
RS485_2_P: Communication (IC1.6 R1.1 R4.1), Terminal (JP1.12)
RS485_A3: Communication (IC2.6 R2.1 R6.1), Terminal (H2.2 H8.2)
RS485_B3: Communication (IC2.7 R2.2 R5.1), Terminal (H2.1 H8.1)
RS485_nW_R2: Communication (IC1.2 IC1.3), MCU_STM32L433RCT6 (IC8.11)
RS485_nW_R3: Communication (IC2.2 IC2.3), MCU_STM32L433RCT6 (IC8.53)
RS485_RX2: Communication (IC1.1), MCU_STM32L433RCT6 (IC8.17)
RS485_RX3: Communication (IC2.1), MCU_STM32L433RCT6 (IC8.52)
RS485_TX2: Communication (IC1.4), MCU_STM32L433RCT6 (IC8.16)
RS485_TX3: Communication (IC2.4), MCU_STM32L433RCT6 (IC8.51)
S_LOCK: DI_DO_AI_AO (IC7.3), Terminal (JP1.6)
SERVO_LOCK: DI_DO_AI_AO (IC7.17), MCU_STM32L433RCT6 (IC8.10)
SHDN: MCU_STM32L433RCT6 (SHIELD.VIT1), Terminal (C12.1 C47.1)
SWCLK: MCU_STM32L433RCT6 (IC8.49), Terminal (H4.4)
SWDIO: MCU_STM32L433RCT6 (IC8.46), Terminal (H4.3)